# EAGLE design lm75_daughterboard_04_routed (EAGLE 5.06)
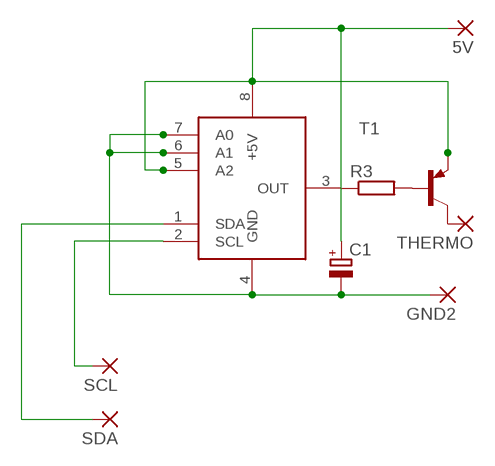
[diagram p0: schematic, sheet 1]

## Parts
5V  2,54/0,8  [2,54/0,8]
C1  CPOL-EUSMCE  [SMC_E]
GND2  2,54/0,8  [2,54/0,8]
R3  R-EU_R1206  [R1206]
SCL  SMD2  [SMD1,27-2,54]
SDA  SMD2  [SMD1,27-2,54]
T1  BC558C-PNP-TO92-EBC  [TO92-EBC]
THERMO  2,54/0,8  [2,54/0,8]
U$1  LM75  [SO8]

## Nets
N$1: C1.- GND2.1(P) U$1.4(GND) U$1.6(A1) U$1.7(A0)
N$3: SDA.1(P) U$1.1(SDA)
N$4: SCL.1(P) U$1.2(SCL)
N$5: 5V.1(P) C1.+ T1.E U$1.5(A2) U$1.8(+5V)
N$6: R3.1 U$1.3(OUT)
N$7: R3.2 T1.B
N$8: T1.C THERMO.1(P)

## Library data of the parts
5V GND2 THERMO = wirepad:2,54/0,8: THROUGH-HOLE PAD
C1 = rcl:CPOL-EU: POLARIZED CAPACITOR, European symbol
R3 = resistor:R-EU_: RESISTOR, European symbol
SCL SDA = wirepad:SMD2: SMD PAD
T1 = transistor:*-PNP-: PNP Transistror
U$1 = lm75:LM75

## Board
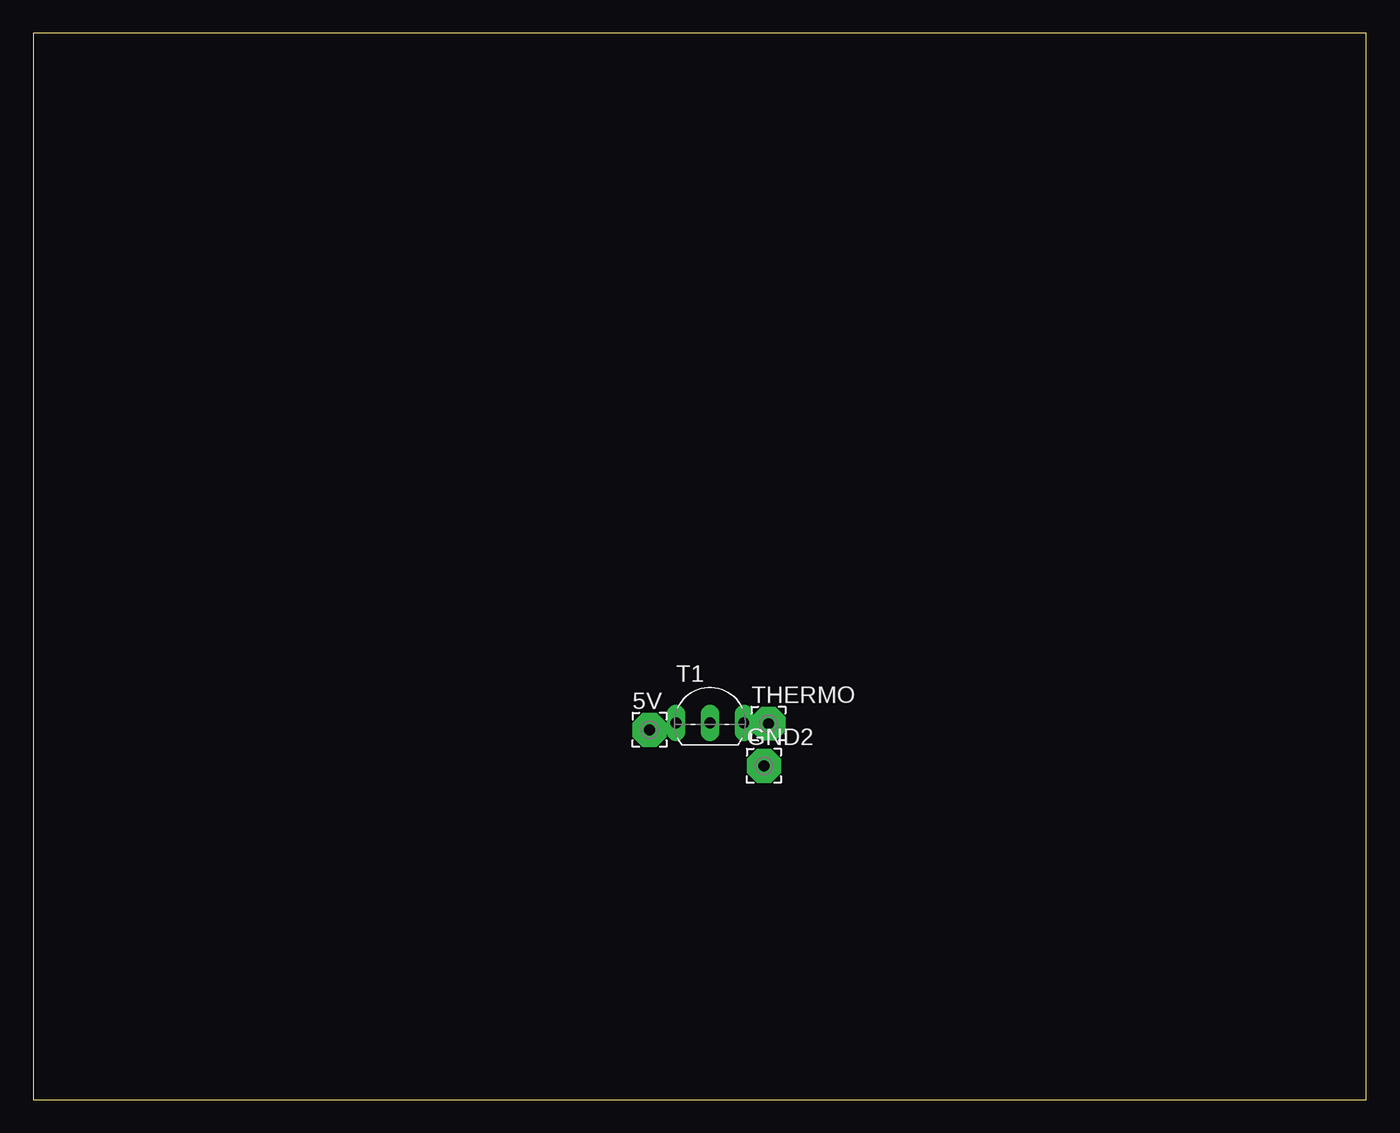
[diagram p1: board, top side]
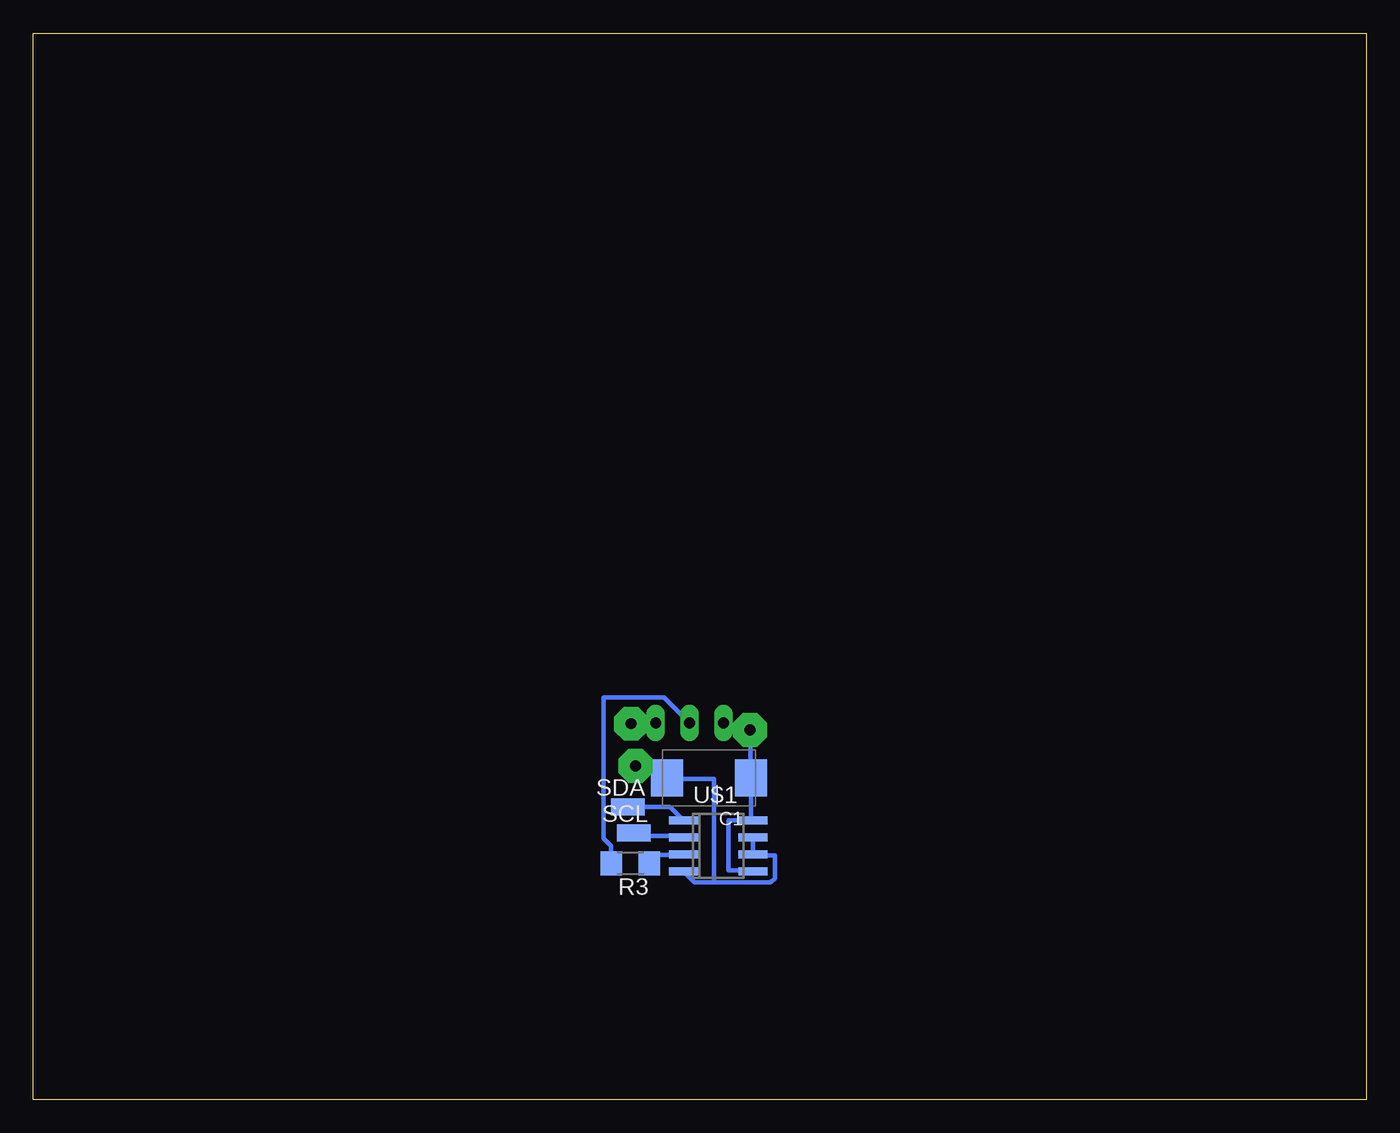
[diagram p2: board, bottom side, seen from below]

Size 100 x 80 mm. Coordinates in mm from the lower left corner, seen from the top.
Outline: 0,0 100,0 100,80 0,80 0,0
Copper layers (1*16): Top 0.035mm / dielectric 1.5mm / Bottom 0.035mm
Design rules "default *": minimum track width 13mil, minimum drill 24mil, track to track 14mil, track to pad 14mil, pad to pad 8mil, via to via 8mil, smd to smd 8mil, copper to edge 0mil, drill to drill 8mil, minimum pad ring 11mil, minimum via ring 8mil, stop-mask expansion 4mil, vias tented up to drill 0mil, thermal gap 10mil

### Footprints (pad centres in the part's own frame; a part is rotated, then mirrored left to right if it is on the bottom)
2,54/0,8 = drill 0.813 pad 2.54 octagon: 1 0,0
SMC_E = smd 2.4 x 2.8: + -3.15,0; - 3.15,0
R1206 = smd 1.6 x 1.803: 1 -1.422,0; 2 1.422,0
SMD1,27-2,54 = smd 1.27 x 2.54: 1 0,0
TO92-EBC = drill 0.813 long: B 0,-1.27; C 2.54,-1.27; E -2.54,-1.27
SO8 = smd 0.6 x 2.2: 1 -1.905,-2.6; 2 -0.635,-2.6; 3 0.635,-2.6; 4 1.905,-2.6; 5 1.905,2.6; 6 0.635,2.6; 7 -0.635,2.6; 8 -1.905,2.6

### Placement (x,y rotation side)
5V  46.23,27.74 0 top
C1  49.31,24.13 180 bottom
GND2  54.81,25.04 0 top
R3  55.2,17.73 180 bottom
SCL  54.95,19.99 270 bottom
SDA  55.4,21.96 270 bottom
T1  50.76,29.53 0 top
THERMO  55.15,28.2 0 top
U$1  48.61,19.04 270 bottom

### Tracks (layer width: path | path; a pad name or v marks a point on that pad's centre or on a via)
N$1
  Bottom 0.33: U$1.7 46.02,19.66 46.02,18.41 U$1.6 45.87,18.31 44.37,18.31 44.37,16.61 44.68,16.31 48.93,16.31 | 48.93,16.31 50.39,16.31 U$1.4 | GND2.1 54.79,25.02 53.34,25.02 52.48,24.16 C1.- 52.3,24.05 48.93,24.05 48.93,16.31
N$3
  Bottom 0.33: U$1.1 51.23,20.95 52.22,21.95 55.4,21.95 SDA.1
N$4
  Bottom 0.33: U$1.2 51.23,19.68 51.47,19.77 54.88,19.77 SCL.1
N$5
  Bottom 0.33: U$1.5 46.02,17.14 46.52,17.2 47.85,17.2 47.84,17.91 47.84,20.93 46.02,20.93 U$1.8 46.15,21.08 C1.+ 46.18,24.28 46.18,27.58 5V.1 46.25,27.76 47.73,27.76 48.21,28.25 T1.E
N$6
  Bottom 0.33: 51.1,18.39 U$1.3 51.36,18.34 53.19,18.34 53.77,17.75 R3.1
N$7
  Bottom 0.33: R3.2 56.64,17.75 56.64,19.02 57.2,19.58 57.2,30.18 52.68,30.18 50.77,28.27 T1.B
N$8
  Bottom 0.33: T1.C 53.31,28.25 53.34,28.22 55.14,28.22 THERMO.1